# EAGLE design test (EAGLE 9.6.2)

## Sheet 1 of 3: Connectors
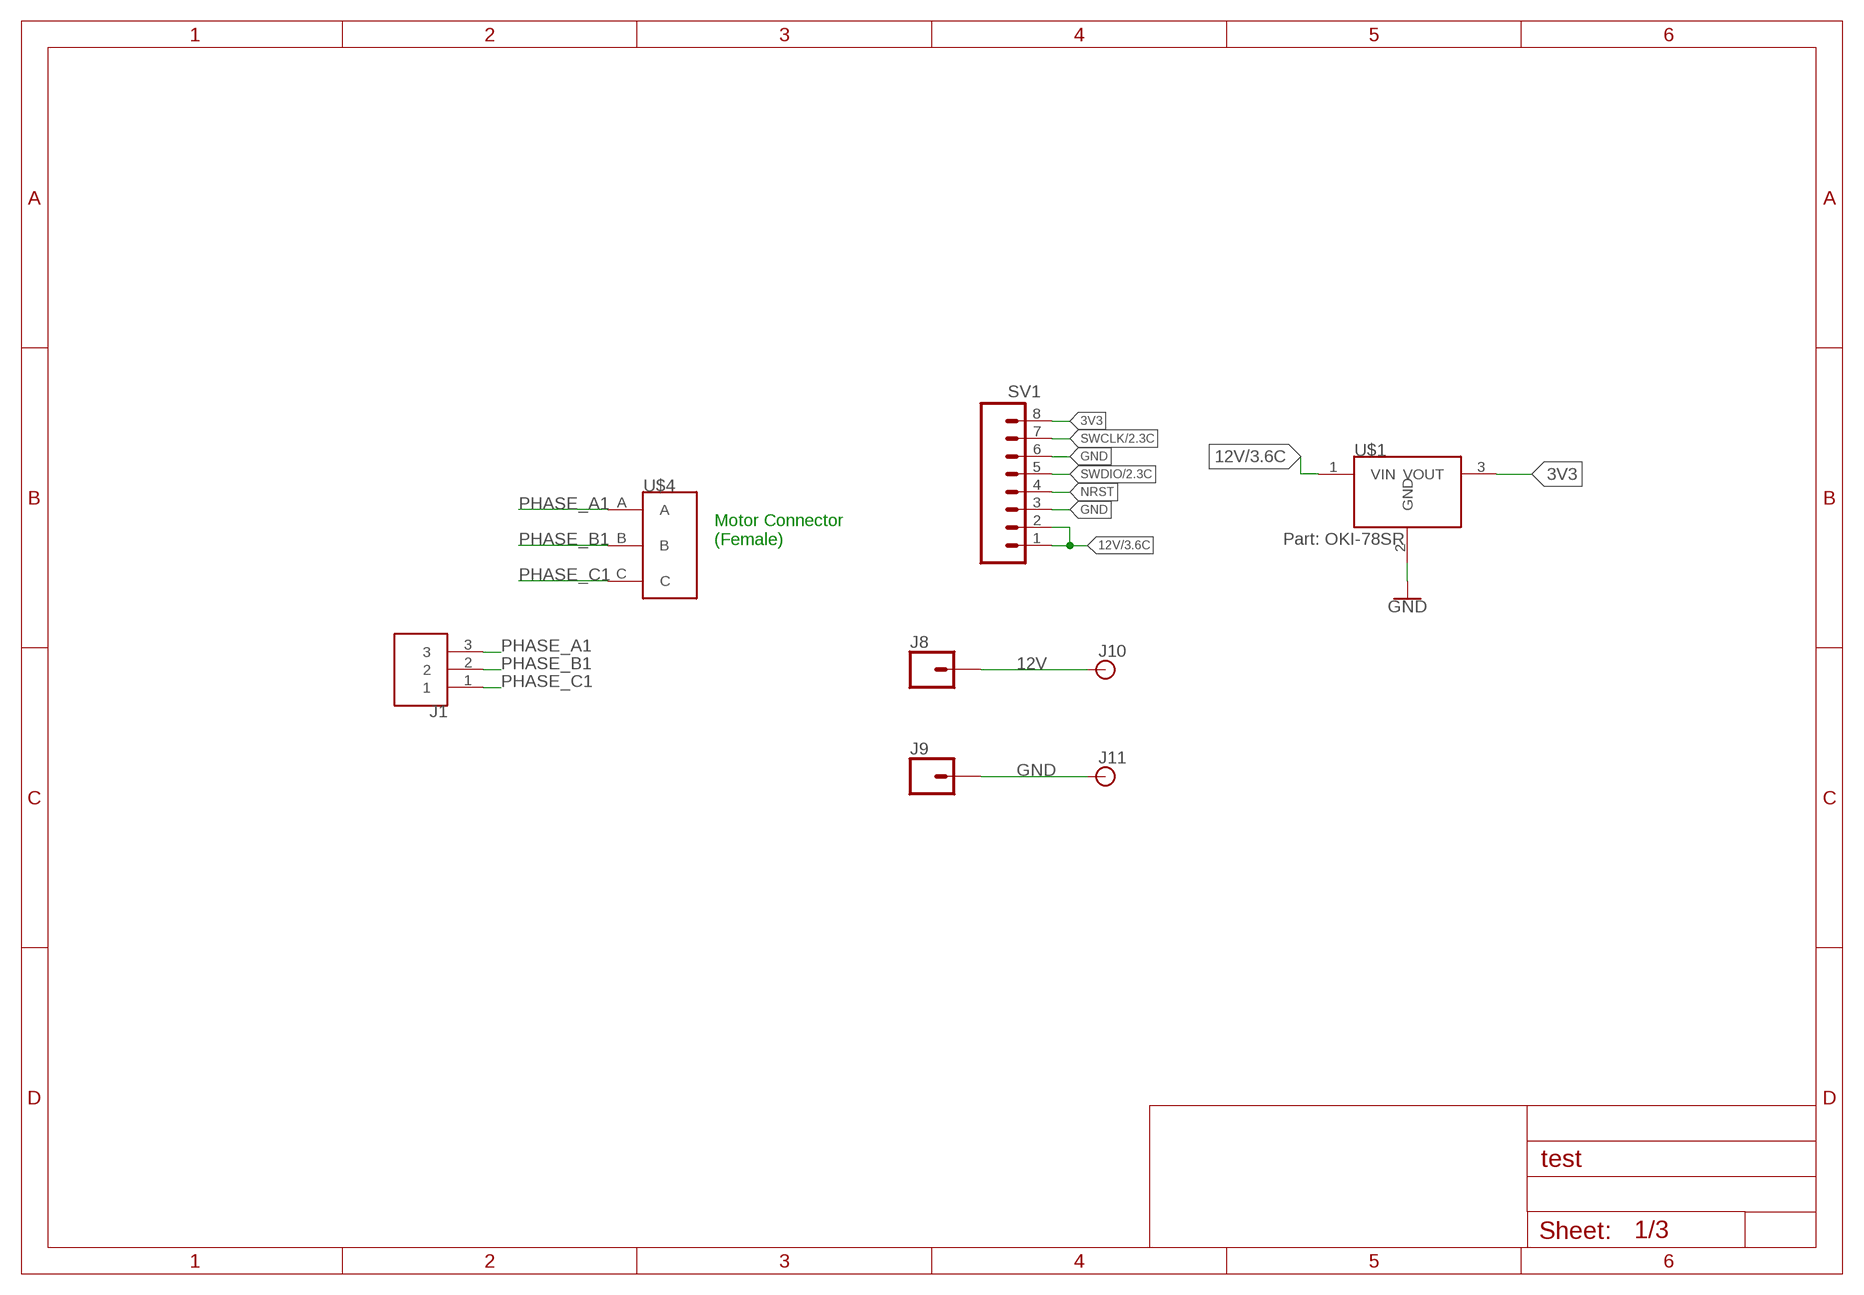
[diagram p0: schematic, sheet 1]

### Parts
J1  284512-3  [284512-3]
J8  CONN_01  [1X01]
J9  CONN_01  [1X01]
J10  BANANA_PTH  [BANANA_CONN_NO_THERM]
J11  BANANA_PTH  [BANANA_CONN_NO_THERM]
SV1  CONN_08"  [1X08]
U$1  MURATA-DC-DC  [MURATA-DC-DC]
U$4  3PINCONNECTOR  [3PINCONNECTOR]

### Nets
3V3: SV1.8 U$1.3(VOUT)
12V: J8.1 J10.1 SV1.1 SV1.2 U$1.1(VIN) ; also sheet 3
GND: J9.1 J11.1 SV1.3 SV1.6 U$1.2(GND) ; also sheet 2,3
NRST: SV1.4 ; also sheet 2
PHASE_A1: J1.3 U$4.A ; also sheet 3
PHASE_B1: J1.2 U$4.B ; also sheet 3
PHASE_C1: J1.1 U$4.C ; also sheet 3
SWCLK: SV1.7 ; also sheet 2
SWDIO: SV1.5 ; also sheet 2

### Notes on the sheet
- Motor Connector
  (Female)

## Sheet 2 of 3: MCU
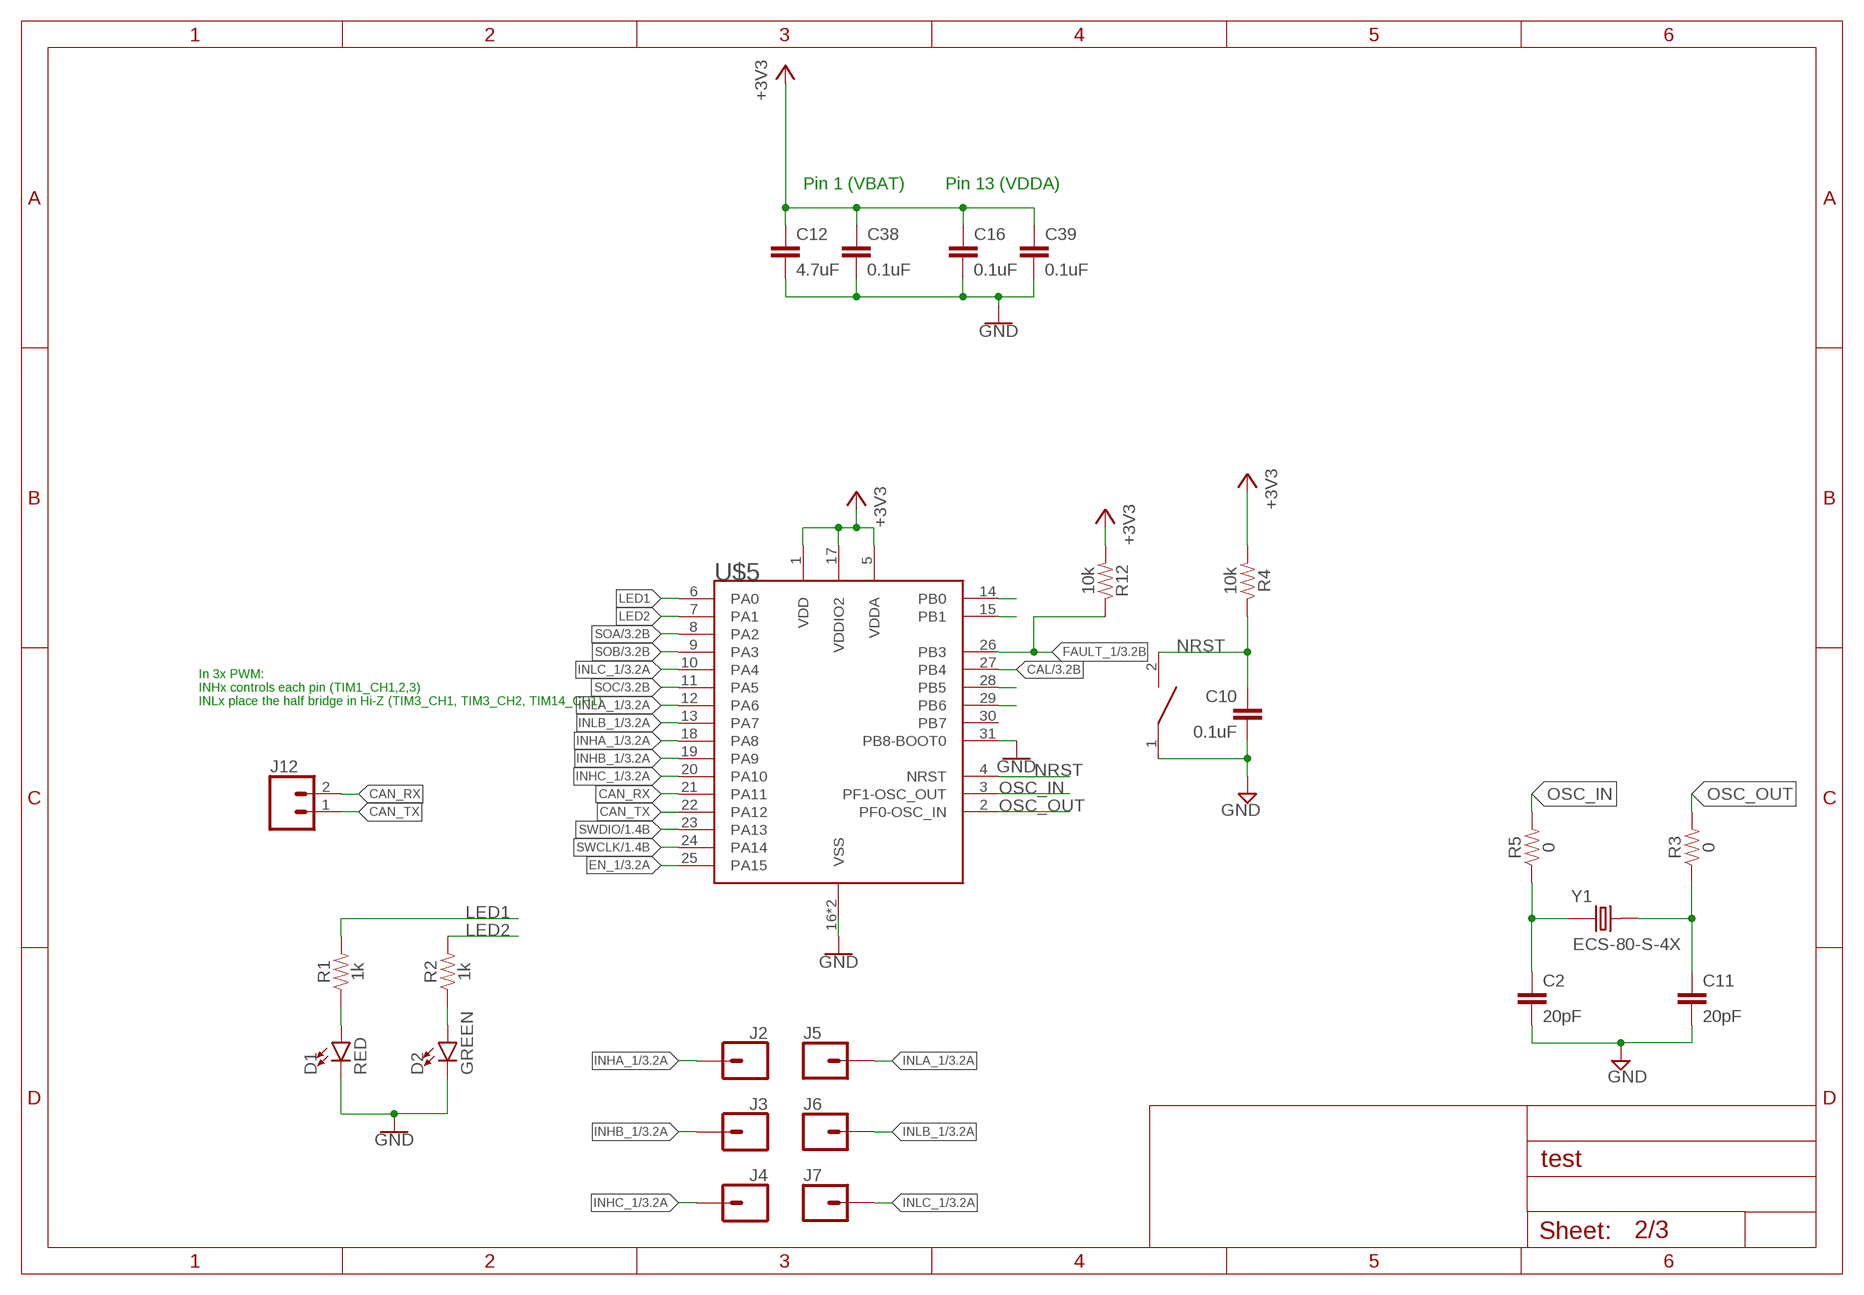
[diagram p1: schematic, sheet 2]

### Parts
C2  20pF  4.7UF0603  [0603]
C10  0.1uF  4.7UF0603  [0603]
C11  20pF  4.7UF0603  [0603]
C12  4.7uF  4.7UF0603  [0603]
C16  0.1uF  4.7UF0603  [0603]
C38  0.1uF  4.7UF0603  [0603]
C39  0.1uF  4.7UF0603  [0603]
D1  RED  LED-0805  [0805]
D2  GREEN  LED-0805  [0805]
J2  CONN_01  [1X01]
J3  CONN_01  [1X01]
J4  CONN_01  [1X01]
J5  CONN_01  [1X01]
J6  CONN_01  [1X01]
J7  CONN_01  [1X01]
J12  CONN_02  [1X02]
R1  1k  1KOHM-0603-1/10W-1%  [0603]
R2  1k  1KOHM-0603-1/10W-1%  [0603]
R3  0  1KOHM-0603-1/10W-1%  [0603]
R4  10k  1KOHM-0603-1/10W-1%  [0603]
R5  0  1KOHM-0603-1/10W-1%  [0603]
R12  10k  1KOHM-0603-1/10W-1%  [0603]
RESET1  DISCRETECOMPONENTS_SWITCH  [DISCRETECOMPONENTS_SW_2512]
U$5  STM32F042K6T6  [LQFP32]
Y1  ECS-80-S-4X  [XTAL_ECS-80-S-4X]

### Nets
+3V3: C12.1 C16.1 C38.1 C39.1 R4.2 R12.2 U$5.1(VDD) U$5.5(VDDA) U$5.17(VDDIO2) ; also sheet 3
CAL: U$5.27(PB4) ; also sheet 3
CAN_RX: J12.2 U$5.21(PA11)
CAN_TX: J12.1 U$5.22(PA12)
EN_1: U$5.25(PA15) ; also sheet 3
FAULT_1: R12.1 U$5.26(PB3) ; also sheet 3
GND: C2.2 C10.2 C11.2 C12.2 C16.2 C38.2 C39.2 D1.C D2.C RESET1.1 U$5.16(VSS) U$5.31(PB8-BOOT0) U$5.32(VSS) ; also sheet 1,3
INHA_1: J2.1 U$5.18(PA8) ; also sheet 3
INHB_1: J3.1 U$5.19(PA9) ; also sheet 3
INHC_1: J4.1 U$5.20(PA10) ; also sheet 3
INLA_1: J5.1 U$5.12(PA6) ; also sheet 3
INLB_1: J6.1 U$5.13(PA7) ; also sheet 3
INLC_1: J7.1 U$5.10(PA4) ; also sheet 3
LED1: R1.2 U$5.6(PA0)
LED1_MID: D1.A R1.1
LED2: R2.2 U$5.7(PA1)
LED2_MID: D2.A R2.1
N$1: U$5.28(PB5)
N$2: U$5.15(PB1)
N$3: U$5.14(PB0)
N$4: U$5.29(PB6)
NRST: C10.1 R4.1 RESET1.2 U$5.4(NRST) ; also sheet 1
OSC_IN: R5.2 U$5.3(PF1-OSC_OUT)
OSC_OUT: R3.2 U$5.2(PF0-OSC_IN)
OSC_XTAL_1: C2.1 R5.1 Y1.1
OSC_XTAL_2: C11.1 R3.1 Y1.2
SOA: U$5.8(PA2) ; also sheet 3
SOB: U$5.9(PA3) ; also sheet 3
SOC: U$5.11(PA5) ; also sheet 3
SWCLK: U$5.24(PA14) ; also sheet 1
SWDIO: U$5.23(PA13) ; also sheet 1
Unconnected: U$5.30(PB7)

### Notes on the sheet
- Pin 1 (VBAT) | Pin 13 (VDDA)
- In 3x PWM:
  INHx controls each pin (TIM1_CH1,2,3)
  INLx place the half bridge in Hi-Z (TIM3_CH1, TIM3_CH2, TIM14_CH1)

## Sheet 3 of 3: Gate Driver
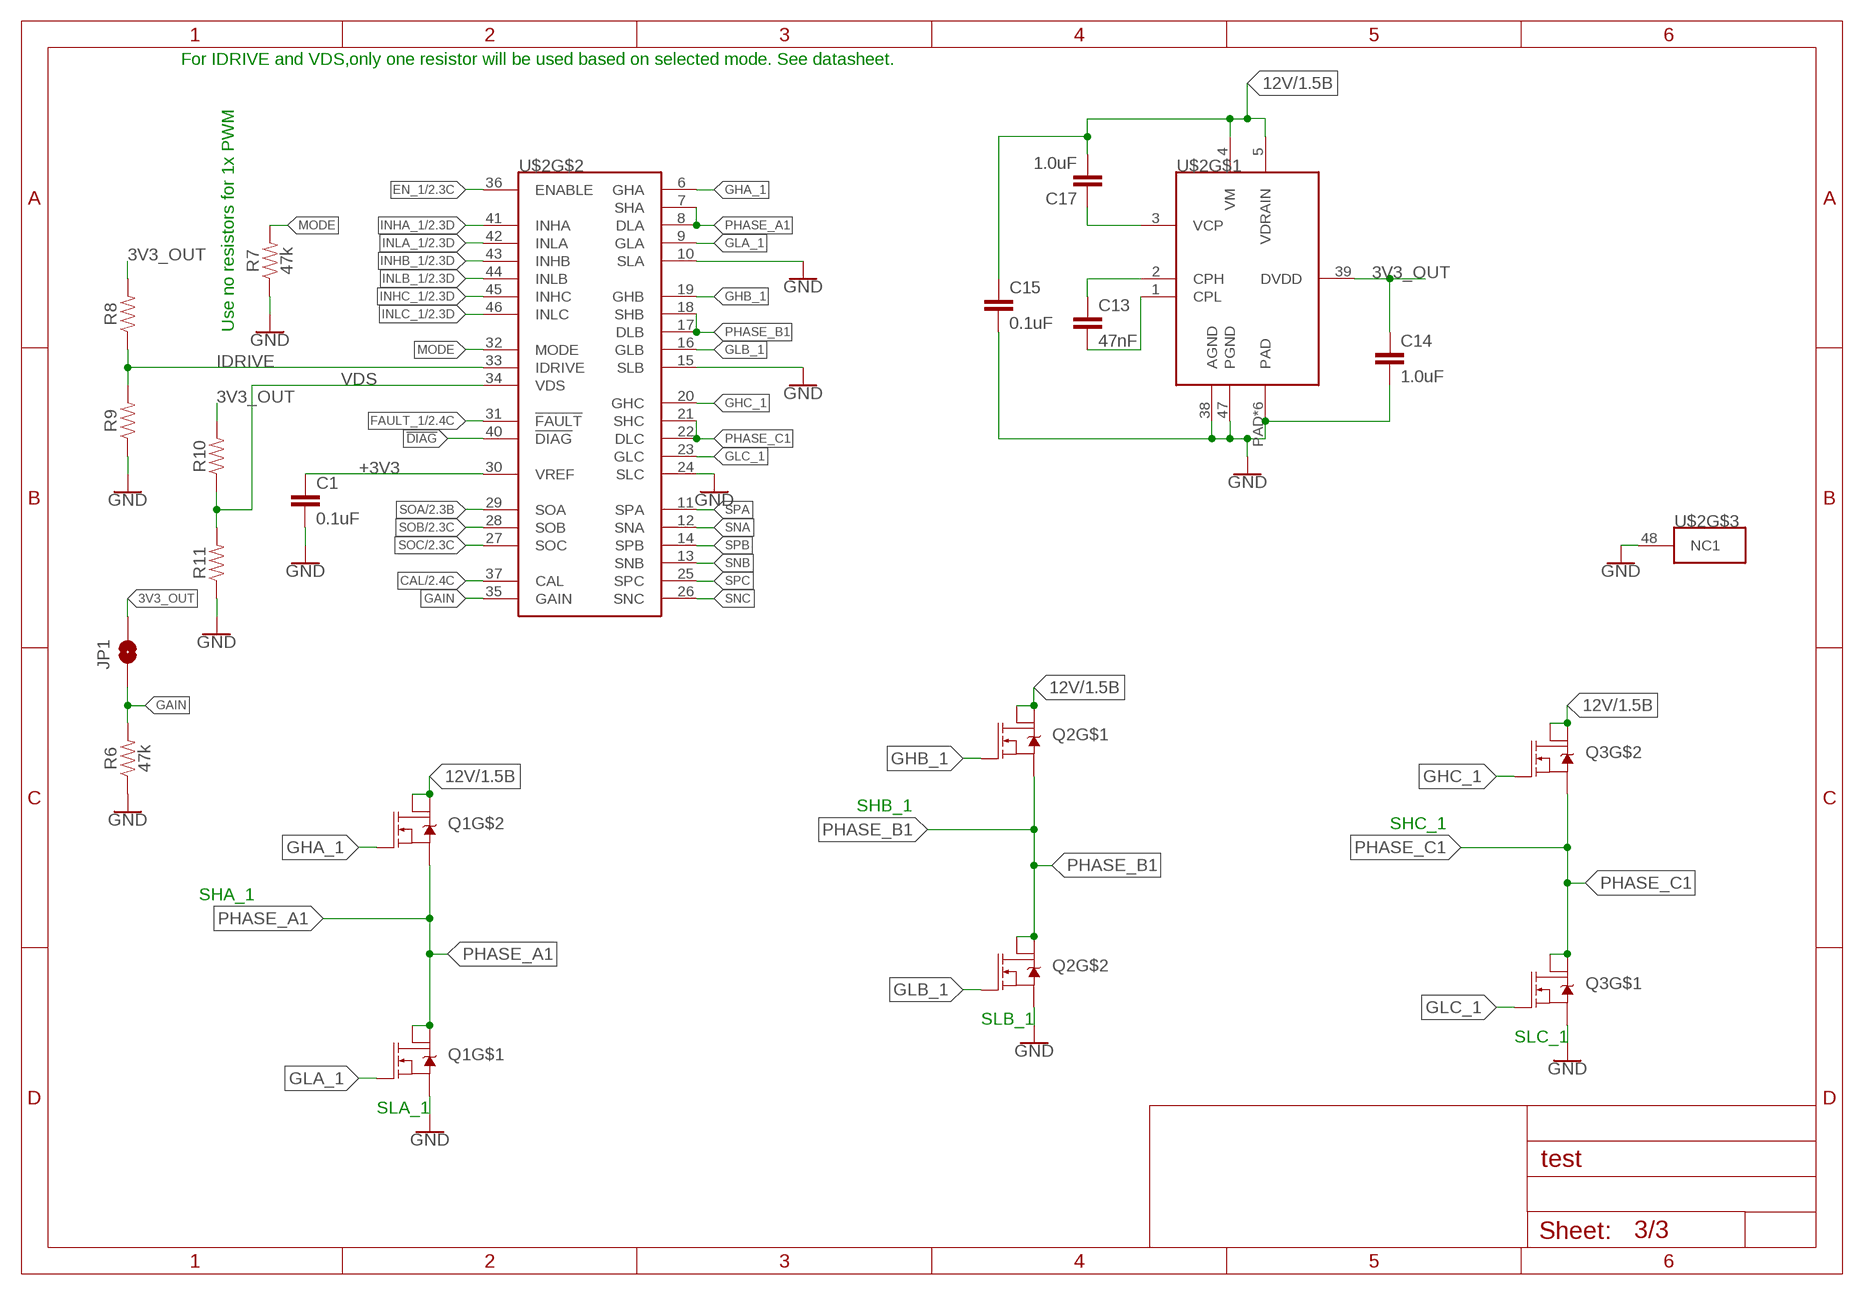
[diagram p2: schematic, sheet 3]

### Parts
C1  0.1uF  0.1UF-0603-25V-(+80/-20%)  [0603]
C13  47nF  47NF-0603-25V-5%  [0603]
C14  1.0uF  1.0UF-0603-16V-10%  [0603]
C15  0.1uF  0.1UF-0603-25V-(+80/-20%)  [0603]
C17  1.0uF  1.0UF-0603-16V-10%  [0603]
JP1  JUMPER-SMT_2_NO_NO-SILK  [SMT-JUMPER_2_NO_NO-SILK]
Q1  DUAL-NMOS  [SO08]
Q2  DUAL-NMOS  [SO08]
Q3  DUAL-NMOS  [SO08]
R6  47k  47KOHM-0603-1/10W-1%  [0603]
R7  47k  47KOHM-0603-1/10W-1%  [0603]
R8  RESISTOR0603  [0603]
R9  RESISTOR0603  [0603]
R10  RESISTOR0603  [0603]
R11  RESISTOR0603  [0603]
U$2  DRV8343H  [48-TQFP-BOTTOM]

### Nets
3V3_OUT: C14.1 JP1.2 R8.2 R10.2 U$2.39(DVDD)
12V: C15.1 C17.2 Q1.5(D1) Q1.6(D2) Q2.7(D1) Q2.8(D2) Q3.5(D1) Q3.6(D2) U$2.4(VM) U$2.5(VDRAIN) ; also sheet 1
!DIAG: U$2.40(!DIAG)
+3V3: C1.1 U$2.30(VREF) ; also sheet 2
CAL: U$2.37(CAL) ; also sheet 2
CPH: C13.1 U$2.2(CPH)
CPL: C13.2 U$2.1(CPL)
EN_1: U$2.36(ENABLE) ; also sheet 2
FAULT_1: U$2.31(!FAULT) ; also sheet 2
GAIN: JP1.1 R6.2 U$2.35(GAIN)
GHA_1: Q1.4(G) U$2.6(GHA)
GHB_1: Q2.2(G) U$2.19(GHB)
GHC_1: Q3.4(G) U$2.20(GHC)
GLA_1: Q1.2(G) U$2.9(GLA)
GLB_1: Q2.4(G) U$2.16(GLB)
GLC_1: Q3.2(G) U$2.23(GLC)
GND: C1.2 C14.2 C15.2 Q1.1(S) Q2.3(S) Q3.1(S) R6.1 R7.1 R9.1 R11.1 U$2.10(SLA) U$2.15(SLB) U$2.24(SLC) U$2.38(AGND) U$2.47(PGND) U$2.48(NC1) U$2.PAD U$2.PAD_BOT(PAD) U$2.PAD_CON1(PAD) U$2.PAD_CON2(PAD) U$2.PAD_CON3(PAD) U$2.PAD_CON4(PAD) ; also sheet 1,2
IDRIVE: R8.1 R9.2 U$2.33(IDRIVE)
INHA_1: U$2.41(INHA) ; also sheet 2
INHB_1: U$2.43(INHB) ; also sheet 2
INHC_1: U$2.45(INHC) ; also sheet 2
INLA_1: U$2.42(INLA) ; also sheet 2
INLB_1: U$2.44(INLB) ; also sheet 2
INLC_1: U$2.46(INLC) ; also sheet 2
MODE: R7.2 U$2.32(MODE)
PHASE_A1: Q1.3(S) Q1.7(D1) Q1.8(D2) U$2.7(SHA) U$2.8(DLA) ; also sheet 1
PHASE_B1: Q2.1(S) Q2.5(D1) Q2.6(D2) U$2.17(DLB) U$2.18(SHB) ; also sheet 1
PHASE_C1: Q3.3(S) Q3.7(D1) Q3.8(D2) U$2.21(SHC) U$2.22(DLC) ; also sheet 1
SNA: U$2.12(SNA)
SNB: U$2.13(SNB)
SNC: U$2.26(SNC)
SOA: U$2.29(SOA) ; also sheet 2
SOB: U$2.28(SOB) ; also sheet 2
SOC: U$2.27(SOC) ; also sheet 2
SPA: U$2.11(SPA)
SPB: U$2.14(SPB)
SPC: U$2.25(SPC)
V_CAP_L: C17.1 U$2.3(VCP)
VDS: R10.1 R11.2 U$2.34(VDS)

### Notes on the sheet
- For IDRIVE and VDS,only one resistor will be used based on selected mode. See datasheet.
- Use no resistors for 1x PWM
- SHB_1
- SHC_1
- SHA_1
- SLB_1
- SLC_1
- SLA_1

## Library data of the parts
C1 C15 = SparkFun-Capacitors:0.1UF: 0.1µF ceramic capacitors A capacitor is a passive two-terminal electrical component used to store electrical energy temporarily in an electric field.; PROD_ID: CAP-00810
C2 C10 C11 C16 C38 C39 = SparkFun-Capacitors:4.7UF: 4.7µF ceramic capacitors A capacitor is a passive two-terminal electrical component used to store electrical energy temporarily in an electric field.; PROD_ID: CAP-08280; VALUE: 4.7uF
C12 = SparkFun-Capacitors:4.7UF: 4.7µF ceramic capacitors A capacitor is a passive two-terminal electrical component used to store electrical energy temporarily in an electric field.; PROD_ID: CAP-08280
C13 = SparkFun-Capacitors:47NF: 47nF ceramic capacitors A capacitor is a passive two-terminal electrical component used to store electrical energy temporarily in an electric field.; PROD_ID: CAP-08605
C14 C17 = SparkFun-Capacitors:1.0UF: 1µF ceramic capacitors A capacitor is a passive two-terminal electrical component used to store electrical energy temporarily in an electric field.; PROD_ID: CAP-00868
D1 D2 = LED-0805:LED-0805; VALUE: COLOR
J1 = ThrusterConnector:284512-3
J2-J9 = SparkFun-Connectors:CONN_01: Single connection point. Often used as Generic Header-pin footprint for 0.1 inch spaced/style header connections On any of the 0.1 inch spaced packages, you can populate with these: Break Away Headers - Straight <https://www.sparkfun.com/products/116> (PRT-00116) Break Away Male Headers - Right Angle <https://www.sparkfun.com/products/553> (PRT-00553) Female Headers <https://www.sparkfun.com/products/115> (PRT-00115) Break Away Headers - Machine Pin <https://www.sparkfun.com/products/117> (PRT-00117) Break Away Female Headers - Swiss Machine Pin <https://www.sparkfun.com/products/743> (PRT-00743) This device is also useful as a general connection point to wire up your design to another part of your project. Our various solder wires solder well into these plated through hole pads. Hook-Up Wire - Assortment (Stranded, 22 AWG) <https://www.sparkfun.com/products/11375> (PRT-11375) Hook-Up Wire - Assortment (Solid Core, 22 AWG) <https://www.sparkfun.com/products/11367> (PRT-11367) View the entire wire category on our website here <https://www.sparkfun.com/categories/141> Special notes: SMTSO-256-ET is a "flush mount" nut for a 4-40 screw. We mostly use this on specialty testbeds; it is a nice way to connect hardware to your PCB at an adjustable hieght. Also note, the SNAP packages are for using a snappable style connector. We sell a baggie of snaps and they are also used on two LilyPad designs: Snap Assortment - 30 pack (male and female) <https://www.sparkfun.com/products/11347> (DEV-11347) LilyPad Arduino SimpleSnap <https://www.sparkfun.com/products/10941> (DEV-10941) LilyPad SimpleSnap Protoboard <https://www.sparkfun.com/products/10940> (DEV-10940)
J10 J11 = Banana Plug PTH:BANANA_PTH
J12 = SparkFun-Connectors:CONN_02: Multi connection point. Often used as Generic Header-pin footprint for 0.1 inch spaced/style header connections On any of the 0.1 inch spaced packages, you can populate with these: Break Away Headers - Straight <https://www.sparkfun.com/products/116> (PRT-00116) Break Away Male Headers - Right Angle <https://www.sparkfun.com/products/553> (PRT-00553) Female Headers <https://www.sparkfun.com/products/115> (PRT-00115) Break Away Headers - Machine Pin <https://www.sparkfun.com/products/117> (PRT-00117) Break Away Female Headers - Swiss Machine Pin <https://www.sparkfun.com/products/743> (PRT-00743) For SCREWTERMINALS and SPRING TERMINALS visit here: Screw Terimnals on SparkFun.com <https://www.sparkfun.com/search/results?term=Screw+Terminals> (5mm/3.5mm/2.54mm spacing) This device is also useful as a general connection point to wire up your design to another part of your project. Our various solder wires solder well into these plated through hole pads. Hook-Up Wire - Assortment (Stranded, 22 AWG) <https://www.sparkfun.com/products/11375> (PRT-11375) Hook-Up Wire - Assortment (Solid Core, 22 AWG) <https://www.sparkfun.com/products/11367> (PRT-11367) View the entire wire category on our website here <https://www.sparkfun.com/categories/141> Special notes: Molex polarized connector foot print use with: PRT-08233 with associated crimp pins and housings. 2.54_SCREWTERM for use with PRT-10571. 3.5mm Screw Terminal footprints for PRT-08084 5mm Screw Terminal footprints for use with PRT-08432
JP1 = SparkFun-Jumpers:JUMPER-SMT_2_NO: Normally open jumper This jumper has two pads in close proximity to each other. Apply solder to close the connection. Round pads are easier to solder for beginners, but are a lot larger. SparkFun Product that uses the round pads: SparkFun EL Sequencer <https://www.sparkfun.com/products/12781>
Q1-Q3 = Dual NMOS:DUAL-NMOS: Recommend TI CSD88537ND
R1 R2 = SparkFun-Resistors:1KOHM: 1kΩ resistor A resistor is a passive two-terminal electrical component that implements electrical resistance as a circuit element. Resistors act to reduce current flow, and, at the same time, act to lower voltage levels within circuits. - Wikipedia; PROD_ID: RES-07856
R3-R5 R12 = SparkFun-Resistors:1KOHM: 1kΩ resistor A resistor is a passive two-terminal electrical component that implements electrical resistance as a circuit element. Resistors act to reduce current flow, and, at the same time, act to lower voltage levels within circuits. - Wikipedia; PROD_ID: RES-07856; VALUE: 1k
R6 R7 = SparkFun-Resistors:47KOHM: 47kΩ resistor A resistor is a passive two-terminal electrical component that implements electrical resistance as a circuit element. Resistors act to reduce current flow, and, at the same time, act to lower voltage levels within circuits. - Wikipedia; PROD_ID: RES-07871
R8-R11 = SparkFun-Resistors:RESISTOR: Generic Resistor Package
RESET1 = Push button - FSM2JMTR:DISCRETECOMPONENTS_SWITCH: TE Connectivity FSM2JMTR Switch
SV1 = SparkFun-Connectors:CONN_08: Multi connection point. Often used as Generic Header-pin footprint for 0.1 inch spaced/style header connections On any of the 0.1 inch spaced packages, you can populate with these: Break Away Headers - Straight <https://www.sparkfun.com/products/116> (PRT-00116) Break Away Male Headers - Right Angle <https://www.sparkfun.com/products/553> (PRT-00553) Female Headers <https://www.sparkfun.com/products/115> (PRT-00115) Break Away Headers - Machine Pin <https://www.sparkfun.com/products/117> (PRT-00117) Break Away Female Headers - Swiss Machine Pin <https://www.sparkfun.com/products/743> (PRT-00743) Arduino Stackable Header - 8 Pin <https://www.sparkfun.com/products/9279> (PRT-09279) For SCREWTERMINALS and SPRING TERMINALS visit here: Screw Terimnals on SparkFun.com <https://www.sparkfun.com/search/results?term=Screw+Terminals> (5mm/3.5mm/2.54mm spacing) This device is also useful as a general connection point to wire up your design to another part of your project. Our various solder wires solder well into these plated through hole pads. Hook-Up Wire - Assortment (Stranded, 22 AWG) <https://www.sparkfun.com/products/11375> (PRT-11375) Hook-Up Wire - Assortment (Solid Core, 22 AWG) <https://www.sparkfun.com/products/11367> (PRT-11367) View the entire wire category on our website here <https://www.sparkfun.com/categories/141> Special notes: Molex polarized connector foot print use with SKU : PRT-08231 with associated crimp pins and housings. 1MM SMD Version SKU: PRT-10208 NOTES ON THE VARIANTS LOCK and LOCK_LONGPADS... This footprint was designed to help hold the alignment of a through-hole component (i.e. 6-pin header) while soldering it into place. You may notice that each hole has been shifted either up or down by 0.005 of an inch from it's more standard position (which is a perfectly straight line). This slight alteration caused the pins (the squares in the middle) to touch the edges of the holes. Because they are alternating, it causes a "brace" to hold the component in place. 0.005 has proven to be the perfect amount of "off-center" position when using our standard breakaway headers. Although looks a little odd when you look at the bare footprint, once you have a header in there, the alteration is very hard to notice. Also,if you push a header all the way into place, it is covered up entirely on the bottom side.; PROD_ID: CONN-08438
U$1 = MURATA_3pin_dcdc:MURATA-DC-DC
U$2 = Motor Driver - DRV834xH:DRV8343H
U$4 = afro_20A_esc:3PINCONNECTOR
U$5 = STM and CAN parts:STM32F042K6T6
Y1 = ECS-80-S-4X:ECS-80-S-4X: CRYSTAL T/H; DESCRIPTION: Crystal 8MHz Series 2-Pin HC-49/U; DIGI-KEY_PART_NUMBER: X1057-ND; DIGI-KEY_PURCHASE_URL: https://www.digikey.com/product-detail/en/ecs-inc/ECS-80-S-4X/X1057-ND/827549?utm_source=snapeda&utm_medium=aggregator&utm_campaign=symbol; MF: ECS International; MP: ECS-80-S-4X; PACKAGE: HC-49/US ECS International

## Net classes
0 default: width 0.203 mm
1 diff_pair: width 0.203 mm, clearance 0.203 mm
2 gpio: width 0.203 mm

## Board
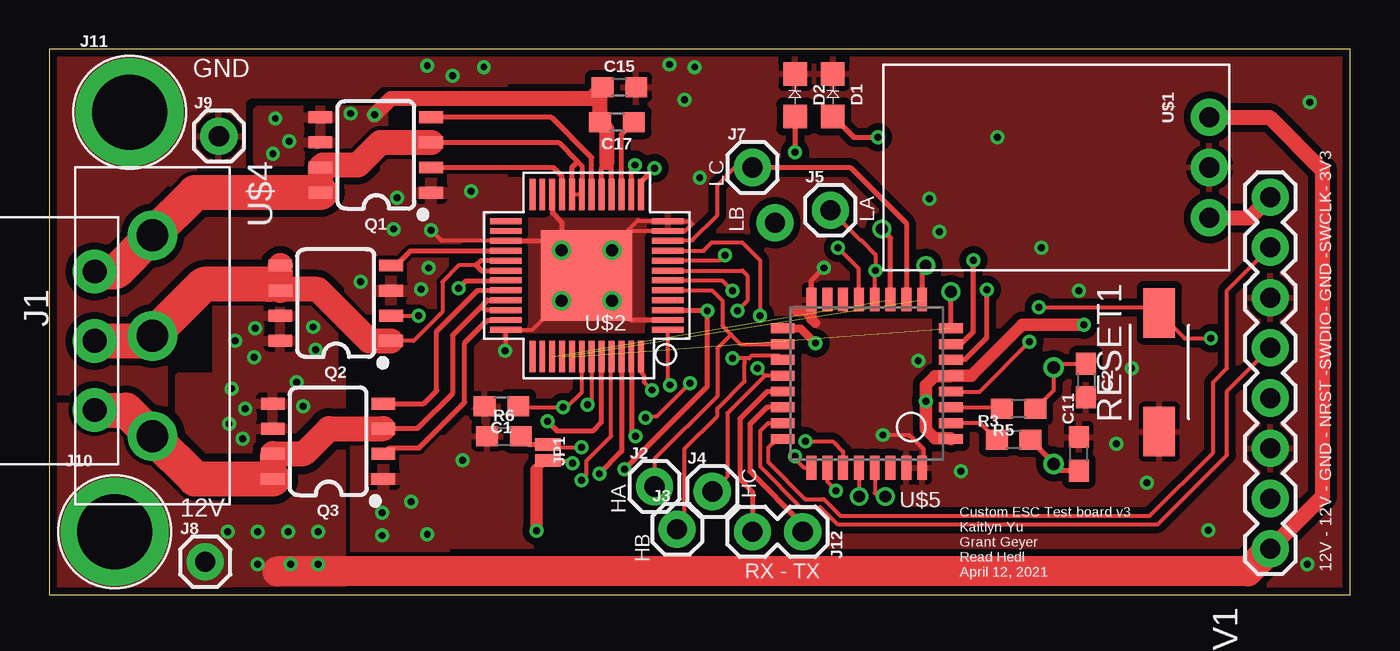
[diagram p3: board, top side]
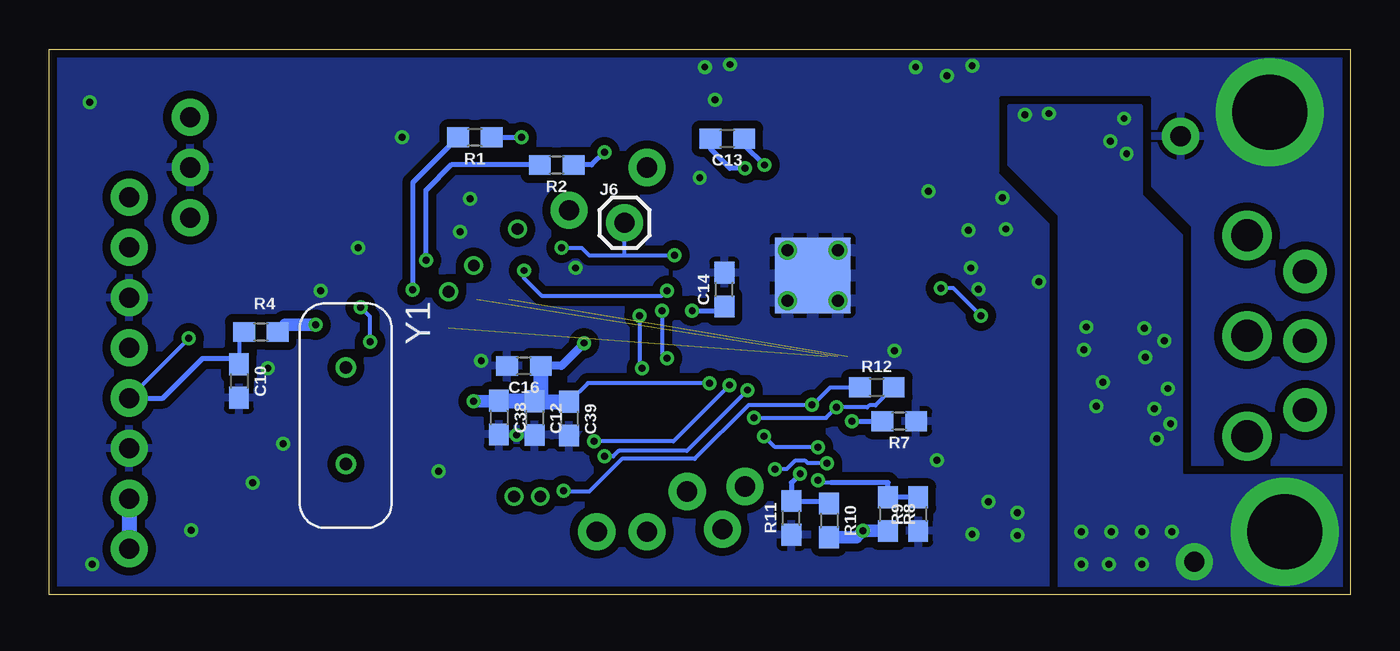
[diagram p4: board, bottom side, seen from below]

Size 65.79 x 27.56 mm. Coordinates in mm from the lower left corner, seen from the top.
Outline: 0,0 65.79,0 65.79,27.56 0,27.56 0,0
Copper layers (1*16): Top 0.0356mm / dielectric 1.5011mm / Bottom 0.0356mm
Design rules "ECE_Senior_Design": minimum track width 8mil, minimum drill 13mil, track to track 8mil, track to pad 8mil, pad to pad 6mil, via to via 8mil, smd to smd 6mil, copper to edge 15mil, drill to drill 8mil, minimum pad ring 7mil, minimum via ring 7mil, stop-mask expansion 3mil, vias tented up to drill 0mil, thermal gap 10mil

### Footprints (pad centres in the part's own frame; a part is rotated, then mirrored left to right if it is on the bottom)
0603 = smd 1.1 x 1: 1 -0.85,0; 2 0.85,0
0805 = smd 1.2 x 1.2: A 1.1,0; C -1.05,0
284512-3 = drill 1.2 pad 2.2: 1 0,3.5; 2 0,0; 3 0,-3.5
1X01 = drill 1.016 pad 1.88: 1 0,0
BANANA_CONN_NO_THERM = drill 3.81 pad 5.461: 1 0,0
1X02 = drill 1.016 pad 1.88: 1 0,0; 2 2.54,0
SMT-JUMPER_2_NO_NO-SILK = smd 0.635 x 1.27: 1 -0.406,0; 2 0.406,0
SO08 = smd 0.6 x 1.2: 1 -1.905,-2.8; 2 -0.635,-2.8; 3 0.635,-2.8; 4 1.905,-2.8; 5 1.905,2.8; 6 0.635,2.8; 7 -0.635,2.8; 8 -1.905,2.8
DISCRETECOMPONENTS_SW_2512 = smd 2.5 x 1.6: 1 -3,0; 2 3,0
1X08 = drill 1.016 pad 1.88: 1 0,0; 2 2.54,0; 3 5.08,0; 4 7.62,0; 5 10.16,0; 6 12.7,0; 7 15.24,0; 8 17.78,0
MURATA-DC-DC = drill 1.016 pad 1.88: 1 -2.54,0; 2 0,0; 3 2.54,0
48-TQFP-BOTTOM = smd 0.3 x 1.6: 1 -2.75,-4.1; 2 -2.25,-4.1; 3 -1.75,-4.1; 4 -1.25,-4.1; 5 -0.75,-4.1; 6 -0.25,-4.1; 7 0.25,-4.1; 8 0.75,-4.1; 9 1.25,-4.1; 10 1.75,-4.1; 11 2.25,-4.1; 12 2.75,-4.1; 25 2.75,4.1; 26 2.25,4.1; 27 1.75,4.1; 28 1.25,4.1; 29 0.75,4.1; 30 0.25,4.1; 31 -0.25,4.1; 32 -0.75,4.1; 33 -1.25,4.1; 34 -1.75,4.1; 35 -2.25,4.1; 36 -2.75,4.1 | smd 1.6 x 0.3: 13 4.1,-2.75; 14 4.1,-2.25; 15 4.1,-1.75; 16 4.1,-1.25; 17 4.1,-0.75; 18 4.1,-0.25; 19 4.1,0.25; 20 4.1,0.75; 21 4.1,1.25; 22 4.1,1.75; 23 4.1,2.25; 24 4.1,2.75; 37 -4.1,2.75; 38 -4.1,2.25; 39 -4.1,1.75; 40 -4.1,1.25; 41 -4.1,0.75; 42 -4.1,0.25; 43 -4.1,-0.25; 44 -4.1,-0.75; 45 -4.1,-1.25; 46 -4.1,-1.75; 47 -4.1,-2.25; 48 -4.1,-2.75 | smd 4.6 x 4.6: PAD 0,0 | smd 3.81 x 3.81 bottom: PAD_BOT 0,0 | drill 0.6: PAD_CON1 -1.27,1.27; PAD_CON2 1.27,1.27; PAD_CON3 -1.27,-1.27; PAD_CON4 1.27,-1.27
3PINCONNECTOR = drill 1.6 pad 2.5: A -5.08,0; B 0,0; C 5.08,0
LQFP32 = smd 1.2 x 0.5: 1 0,5.6; 2 0,4.8; 3 0,4; 4 0,3.2; 5 0,2.4; 6 0,1.6; 7 0,0.8; 8 0,0; 17 8.5,0; 18 8.5,0.8; 19 8.5,1.6; 20 8.5,2.4; 21 8.5,3.2; 22 8.5,4; 23 8.5,4.8; 24 8.5,5.6 | smd 0.5 x 1.2: 9 1.45,-1.45; 10 2.25,-1.45; 11 3.05,-1.45; 12 3.85,-1.45; 13 4.65,-1.45; 14 5.45,-1.45; 15 6.25,-1.45; 16 7.05,-1.45; 25 7.05,7.05; 26 6.25,7.05; 27 5.45,7.05; 28 4.65,7.05; 29 3.85,7.05; 30 3.05,7.05; 31 2.25,7.05; 32 1.45,7.05
XTAL_ECS-80-S-4X = drill 0.63 pad 1.03: 1 -2.44,0; 2 2.44,0

### Placement (x,y rotation side)
C1  22.86,9.53 180 top
C2  52.43,10.82 270 top
C10  56.2,10.79 270 bottom
C11  52.07,7.11 90 top
C12  41.25,8.92 270 bottom
C13  31.5,23.05 180 bottom
C14  31.65,15.42 90 bottom
C15  28.83,25.65 0 top
C16  41.78,11.56 180 bottom
C17  28.7,23.88 180 top
C38  43.05,8.94 270 bottom
C39  39.5,8.89 270 bottom
D1  39.62,25.27 270 top
D2  37.72,25.27 270 top
J1  2.29,12.83 180 top
J2  30.61,5.46 0 top
J3  31.75,3.3 0 top
J4  33.53,5.21 0 top
J5  39.5,19.43 0 top
J6  36.7,18.8 0 bottom
J7  35.56,21.59 0 top
J8  7.87,1.65 0 top
J9  8.57,23.18 0 top
J10  3.3,3.17 0 top
J11  4.06,24.38 0 top
J12  38.1,3.17 180 top
JP1  25.21,7.18 270 top
Q1  16.51,22.23 90 top
Q2  14.48,14.73 90 top
Q3  14.1,7.75 90 top
R1  44.27,23.11 180 bottom
R2  40.13,21.72 180 bottom
R3  48.77,7.82 180 top
R4  55.09,13.27 0 bottom
R5  49.02,9.4 180 top
R6  22.99,8 0 top
R7  22.8,8.76 180 bottom
R8  23.37,4.06 270 bottom
R9  21.84,4.06 90 bottom
R10  26.35,3.75 270 bottom
R11  28.26,3.87 90 bottom
R12  23.94,10.48 0 bottom
RESET1  56.13,11.24 90 top
SV1  61.75,2.31 90 top
U$1  58.67,21.59 270 top
U$2  27.18,16.13 180 top
U$4  5.21,13.08 270 top
U$5  45.59,13.46 180 top
Y1  50.8,9.04 270 bottom

### Tracks (layer width: path | path; a pad name or v marks a point on that pad's centre or on a via)
3V3
  Top 0.762: U$1.3 60.71,19.05 SV1.8
3V3_OUT  (via drill 0.35)
  Top 0.203: v26.45,6.64 26.32,6.77 JP1.2 24.74,6.3 24.64,6.3
  Top 0.254: v29.08,6.33 33.27,10.53 v33.27,14.35 33.25,14.38 U$2.39
  Top 0.635: 24.64,6.3 v24.64,3.21
  Bottom 0.203: v29.08,6.33 28.5,6.33 28.09,6.75 27.54,6.75 27.43,6.64 v26.45,6.64
  Bottom 0.254: v33.27,14.35 31.86,14.35 C14.1
  Bottom 0.635: R8.2 v24.64,3.21 24.96,2.9 R10.2
12V  (via drill 0.35)
  Top 0.254: U$2.5 27.93,21.58 28.19,21.84 28.43,21.61 U$2.4
  Top 0.762: SV1.1 64.39,4.95 64.39,21.46 61.72,24.13 U$1.1 | 28.19,21.84 28.19,23.53 C17.2 27.85,25.53 C15.1 27.41,25.08 17.27,25.08 v16.45,24.26
  Top 1.524: 11.53,1.17 60.6,1.17 SV1.1
  Bottom 0.762: SV1.2 SV1.1
  other vias: 9.02,3.17 10.54,3.17 12.06,3.17 13.59,3.17 13.59,1.52 12.19,1.52 10.54,1.52 9.4,12.83 9.91,9.4 12.13,22.92 11.43,24.07 10.35,12 9.08,8.64 10.41,13.46 9.78,7.87 12.83,9.53 9.21,10.41 13.46,12.38 13.34,13.53 12.51,10.73 15.24,24.32 11.3,22.29
  pour Top (isolate 0.406): 6.6,-1.78 6.6,10.99 14.73,10.99 14.73,-1.78
  pour Bottom: 8.51,-3.17 8.51,18.16 10.54,20.19 10.54,24.7 17.27,24.7 17.27,21.72 14.73,19.18 14.73,-3.17
  pour Top: 8.51,15.81 11.87,15.81 14.35,13.34 14.35,10.79 8.51,10.79
  pour Top: 10.54,21.91 15.05,21.91 16.89,23.75 16.89,24.45 10.54,24.45
  pour Top (no thermals): -3.56,-2.67 -3.56,9.65 3.81,9.65 9.14,4.32 9.14,-2.67
  pour Bottom (no thermals): -1.14,-0.64 -1.14,5.97 8.95,5.97 10.6,5.97 10.6,-0.51 10.6,-0.64
+3V3  (via drill 0.35)
  Top 0.203: v30.14,8.93 30.21,9 30.71,9 v32.41,10.69 | U$2.30 26.93,10.22 26.17,9.46 v25.97,9.46 23.77,9.46 C1.1
  Top 0.406: U$5.17 37.99,13.46 v38.73,12.71
  Top 0.635: v52.32,13.64 49.2,13.64 46.62,11.06 U$5.5 45.56,11.03 44.78,11.03 44.32,10.58 v44.32,9.78 44.32,8.35 44.78,7.89 45.56,7.89 U$5.1
  Bottom 0.203: v30.14,8.93 27.5,8.93 26.5,8.93 v25.97,9.46 24.43,9.46 24.32,9.57 24,9.57 R12.2 | v32.41,10.69 38.55,10.69 C39.1
  Bottom 0.406: v38.73,12.71 39.89,11.56 C16.1
  Bottom 0.635: v52.32,13.64 53.87,13.64 R4.2 | v44.32,9.78 43.06,9.78 | C38.1 42.67,9.79
  Bottom 0.762: 42.67,9.79 41.27,9.79 C12.1 | 43.06,9.78 C38.1 | C12.1 41.22,9.74 C39.1 | C16.1 40.93,10.08 C12.1
CAL  (via drill 0.35)
  Top 0.203: v38.25,7.75 39.62,7.75 40.14,7.23 U$5.27 | U$2.37 31.28,10.69 v31.38,10.59
  Bottom 0.203: v31.38,10.59 34.22,7.75 v38.25,7.75
CAN_RX
  Top 0.254: U$5.21 36.3,10.26 34.92,8.89 34.92,5.84 35.56,5.21 J12.2
CAN_TX
  Top 0.254: U$5.22 36.28,9.46 35.43,8.61 35.43,6.22 38.1,3.56 J12.1
CPH  (via drill 0.35)
  Top 0.254: v29.61,21.72 29.43,21.53 U$2.2
  Bottom 0.254: C13.1 30.65,22.75 v29.61,21.72
CPL  (via drill 0.35)
  Top 0.254: U$2.1 29.93,20.87 v30.61,21.55
  Bottom 0.254: C13.2 32.35,22.53 31.37,21.55 v30.61,21.55
EN_1  (via drill 0.35)
  Top 0.203: U$2.36 29.93,11.22 30.07,11.08 30.07,10.74 v30.47,10.34 | v37.72,6.99 37.72,6.86 38.16,6.41 U$5.25
  Bottom 0.203: v30.47,10.34 33.54,7.26 37,7.26 37.28,6.99 v37.72,6.99
FAULT_1  (via drill 0.35)
  Top 0.203: v39.79,5.26 39.34,5.71 U$5.26 | U$2.31 27.43,9.79 v27.23,9.59
  Bottom 0.203: v39.79,5.26 39.74,5.21 38.48,5.21 36.83,6.86 33.15,6.86 30.41,9.59 v27.23,9.59 27.18,9.59 26.29,10.48 R12.1
GAIN  (via drill 0.35)
  Top 0.203: 25.23,7.56 25.34,7.45 v26.92,7.45
  Top 0.254: R6.2 24.26,7.58 JP1.1 25.23,7.56 | v29.64,8 29.45,8.2 29.45,12.01 U$2.35
  Bottom 0.203: v26.92,7.45 29.09,7.45 v29.64,8
GHA_1
  Top 0.254: Q1.4 25.39,24.13 27.43,22.09 U$2.6
GHB_1  (via drill 0.35)
  Top 0.203: Q2.2 v18.67,14.1
  Top 0.254: U$2.19 23.06,15.86 21.07,15.86 v20.7,15.49
  Bottom 0.203: v18.67,14.1 20.07,15.49 v20.7,15.49
GHC_1
  Top 0.254: Q3.4 18.92,9.65 19.58,10.31 19.58,13.31 21.65,15.38 U$2.20
GLA_1
  Top 0.254: U$2.9 25.91,20.25 25.91,21.17 25.48,21.59 Q1.2
GLB_1
  Top 0.254: Q2.4 17.53,16.64 18.27,17.38 U$2.16
GLC_1
  Top 0.254: U$2.23 23.06,13.86 22.14,13.86 21.01,12.72 21.01,9.72 18.7,7.42 17.2,7.42 Q3.2
GND  (via drill 0.35)
  Top 0.203: v23.05,12.32 23.08,12.35 U$2.24 24.43,13.38 U$2.PAD_CON2 | 29.24,18.38 29.78,18.92 29.83,18.88 U$2.48 32.37,18.88 32.51,18.73 32.16,18.38 U$2.47 29.25,18.38 29.24,18.38 | 29.24,18.38 28.45,17.59 U$2.PAD_CON3 | U$2.15 19.84,17.88 v19.3,18.41 | U$5.32 44.21,6.48 44.21,7.36 43.5,8.06 v42.16,8.06
  Top 0.254: U$2.15 25.43,17.88 U$2.PAD_CON4 25.91,18.83 25.45,19.29 25.45,20.21 U$2.10 | 29.21,17.4 U$2.PAD_CON3 | U$2.38 29.43,13.88 U$2.PAD_CON1 | U$5.16 38.54,15.87 v39.18,16.51
  Top 0.508: U$5.16 38.54,14.04 | 38.54,14.04 38.54,13.91 38.73,13.72 | 38.54,14.04 38.23,14.35 37.72,14.35
  other vias: 52.07,15.37 63.63,1.52 63.75,24.89 54.74,11.43 32.64,26.67 32.13,25.02 32.89,21.08 31.37,26.8 43.94,11.81 46.1,6.22 20.89,6.79 17.4,18.48 16.83,2.98 18.29,4.7 19.11,3.05 15.75,15.81 19.18,16.51 21.34,20.38 17.59,20.07 16.83,4.13 18.8,15.43 21.97,26.67 20.38,26.23 19.11,26.73 44.51,20 45.02,18.35 47.94,23.11 50.16,17.53 53.98,7.62 55.5,5.65 58.61,3.24
  pour Top (isolate 0.356, rank 6): -1.02,28.32 -1.02,-0.38 67.06,-0.38 67.06,28.32
  pour Bottom (isolate 0.406, rank 6): -2.03,29.08 -2.03,-0.89 68.83,-0.89 68.83,29.08
  pour Top (isolate 0.152, rank 2): 15.24,-3.17 15.24,19.05 17.02,20.83 17.02,30.1 22.86,30.1 22.86,20.19 19.94,17.27 19.94,-3.17
  pour Bottom: 23.75,19.05 23.75,12.57 30.35,12.57 30.35,19.05
  pour Top (no thermals): -1.78,29.34 7.37,29.34 7.37,20.7 -1.78,20.7
  pour Top (no thermals): 24.51,18.86 29.91,18.86 29.91,13.4 24.38,13.4 24.38,18.86
IDRIVE  (via drill 0.35)
  Top 0.203: v26.9,5.78 27.16,6.03 27.16,6.75 28.41,8.01 28.41,12.01
  Top 0.254: 28.41,12.01 U$2.33
  Bottom 0.203: 26.24,5.65 26.78,5.65 v26.9,5.78
  Bottom 0.254: R9.2 R8.1 23.37,5.65 26.24,5.65
INHA_1
  Top 0.203: U$2.41 33.52,15.38 34.04,14.86 34.04,13.59 34.48,13.14 | 34.48,13.14 34.96,12.66 U$5.18 | J2.1 30.61,6.86 33.78,10.03 33.78,12.45 34.48,13.14
INHB_1  (via drill 0.35)
  Top 0.203: U$2.43 35.06,16.38 35.31,16.13 35.31,14.86 v34.8,14.35 | 35.18,11.94 35.39,11.94 35.54,12.09 36.87,12.09 U$5.19 | J3.1 32.13,3.68 32.13,7.37 33.78,9.02 33.78,9.4 35.16,10.77 35.16,11.7 35.18,11.72 35.18,11.94 | 35.18,11.94 v34.54,11.94
  Bottom 0.203: v34.8,14.35 34.8,12.19 v34.54,11.94
INHC_1  (via drill 0.35)
  Top 0.203: U$2.45 33.09,17.38 33.51,17.8 35.03,17.8 35.94,16.89 v35.94,14.1 | U$5.20 36.18,11.06 | J4.1 34.29,5.97 34.29,9.17 36.18,11.06 | 36.18,11.06 v35.81,11.43
  Bottom 0.203: v35.94,14.1 35.94,11.56 v35.81,11.43
INLA_1  (via drill 0.35)
  Top 0.203: U$5.12 41.74,16.34 v41.78,16.38 41.78,17.19 41.04,17.93 41,17.93 J5.1 | v34.54,15.37 34.04,15.88 U$2.42
  Bottom 0.203: v41.78,16.38 41.78,16 40.89,15.11 34.8,15.11 v34.54,15.37
INLB_1  (via drill 0.35)
  Top 0.203: U$5.13 40.94,16.46 v39.88,17.53 | v34.16,17.14 33.9,16.88 U$2.44
  Bottom 0.203: v39.88,17.53 38.86,17.53 38.48,17.14 36.7,17.14 | 36.7,17.14 v34.16,17.14 | 36.7,17.14 J6.1
INLC_1
  Top 0.203: 35.31,21.59 34.67,21.59 33.78,20.7 33.78,19.18 32.51,17.91 31.5,17.91 31.31,17.91 U$2.46
  Top 0.254: 35.31,21.59 J7.1 40.51,21.59 43.34,18.76 U$5.10
LED1  (via drill 0.35)
  Top 0.254: v47.41,15.4 47.41,12.97 46.33,11.89 45.62,11.89 U$5.6
  Bottom 0.254: R1.2 47.41,20.83 v47.41,15.4
LED1_MID  (via drill 0.35)
  Top 0.254: D1.A 40.68,23.11 v41.91,23.11
  Bottom 0.254: R1.1 v41.91,23.11
LED2  (via drill 0.35)
  Top 0.254: U$5.7 46.11,12.66 46.73,13.28 v46.73,16.9
  Bottom 0.203: v46.73,16.9 v46.74,16.9
  Bottom 0.254: R2.2 45.47,21.72 46.74,20.45 v46.74,16.9
LED2_MID  (via drill 0.35)
  Top 0.254: D2.A v37.72,22.35
  Bottom 0.254: v37.72,22.35 38.35,21.72 R2.1
MODE  (via drill 0.35)
  Top 0.254: v25.18,8.77 25.69,8.26 27.47,8.26 27.91,8.7 27.91,12.01 U$2.32
  Bottom 0.254: v25.18,8.77 v25.18,8.76 R7.2
N$1  (via drill 0.6)
  Top 0.203: U$5.28 40.94,4.97 v40.96,4.95
N$4  (via drill 0.6)
  Top 0.203: U$5.29 41.74,5.14 41.85,5.04 42.21,5.04 v42.29,4.95
NRST  (via drill 0.35)
  Top 0.203: U$5.4 47.06,10.26 v49.57,12.77 | v50.04,14.52 55.85,14.52 RESET1.2 57.42,12.95 v58.74,12.95
  Bottom 0.203: v49.57,12.77 49.57,14.05 v50.04,14.52 | R4.1 56.2,13.02 C10.1 | v58.74,12.95 v58.74,12.94 SV1.4
  Bottom 0.254: SV1.4 60.05,9.93 58.04,11.94 56.49,11.94 C10.1
OSC_IN
  Top 0.203: U$5.3 48.11,9.46 R5.2
OSC_OUT
  Top 0.203: R3.2 47.08,8.66 U$5.2
OSC_XTAL_1
  Top 0.203: R5.1 50.8,10.33 Y1.1 50.99,11.67 C2.1
OSC_XTAL_2
  Top 0.254: C11.1 51.14,6.26 Y1.2 50.8,6.64 R3.1
PHASE_A1
  Top 0.203: U$2.8 U$2.7
  Top 0.254: Q1.3 25.74,22.86 26.71,21.89 | 26.71,21.89 26.93,21.67 U$2.7 | 26.71,21.89 26.43,21.6 U$2.8
  Top 1.27: Q1.8 Q1.7 13.84,21.72 15.61,21.72 16.75,22.86 Q1.3
  Top 1.778: J1.3 3.37,16.33 U$4.A 7.37,20.32 Q1.8
PHASE_B1
  Top 0.203: 21.59,16.64 20.7,16.64 19.88,15.81 19.88,14.29 18.41,12.83 Q2.1
  Top 0.254: U$2.17 21.83,16.88 21.59,16.64 21.85,16.38 U$2.18
  Top 1.27: 4.95,12.83 U$4.B | 11.11,15.68 11.68,16.26 Q2.5 Q2.6 11.74,15.43 13.58,15.43 16.18,12.83 Q2.1
  Top 1.778: J1.2 4.95,12.83 | U$4.B 7.81,15.68 11.11,15.68
PHASE_C1
  Top 0.254: 21.86,14.59 22.16,14.88 U$2.21 | Q3.3 18.61,8.38 20.38,10.16 20.38,13.11 21.86,14.59 | U$2.22 22.07,14.38 21.86,14.59
  Top 1.27: Q3.8 Q3.7 12.88,7.12 14.14,8.38 Q3.3
  Top 1.778: J1.1 3.88,9.33 U$4.C 7.37,5.84 Q3.8
SOA  (via drill 0.6)  (1 unrouted)
  Top 0.254: U$5.8 v45.59,15.3
SOB  (via drill 0.6)  (1 unrouted)
  Top 0.203: U$2.28 25.88,11.98
  Top 0.254: U$5.9 44.14,16.46 v44.32,16.64
SOC  (via drill 0.6)  (1 unrouted)
  Top 0.254: U$5.11 42.54,18.04 v42.1,18.48
SWCLK
  Top 0.203: SV1.7 59.56,15.37 59.56,11.43 58.86,10.73 58.86,7.18 55.66,3.97 40.02,3.97 39.16,4.83 38.23,4.83 36.35,6.71 36.35,7.42 36.79,7.86 U$5.24
SWDIO
  Top 0.203: SV1.5 59.56,10.29 59.56,7.05 56.07,3.56 39.86,3.56 39,4.42 38,4.42 35.94,6.48 35.94,8.25 36.35,8.66 U$5.23
V_CAP_L
  Top 0.254: U$2.3 28.93,23.25 C17.1
VDS  (via drill 0.35)
  Top 0.254: v27.81,6.1 28.95,7.23 28.95,12.01 U$2.34
  Bottom 0.254: R10.1 26.48,4.72 R11.2 28.26,5.65 v27.81,6.1

### Text on the board
tNames: GND | LC | LB | LA | HC | 12V | HA | HB | Custom ESC Test board v3 / Kaitlyn Yu / Grant Geyer / Read Hedl / April 12, 2021 | 12V - 12V - GND - NRST -SWDIO- GND -SWCLK- 3V3 | RX - TX